# Altium schematic sheet 8051_MOV.SchDoc
size A3; PageSetup: Record=PageOptions|CenterHorizontal=True|CenterVertical=True|PrintScale=0.70|XCorrection=1.00|YCorrection=1.00|PrintKind=1|BorderSize=5000000|LeftOffset=0|BottomOffset=0|Orientation=2|PaperLength=2794|PaperWidth=2159|Scale=100|PaperSource=7|PrintQuality=600|MediaType=1|DitherType=10|PrintScaleMode=1|PaperKind=Letter|PaperIndex=1
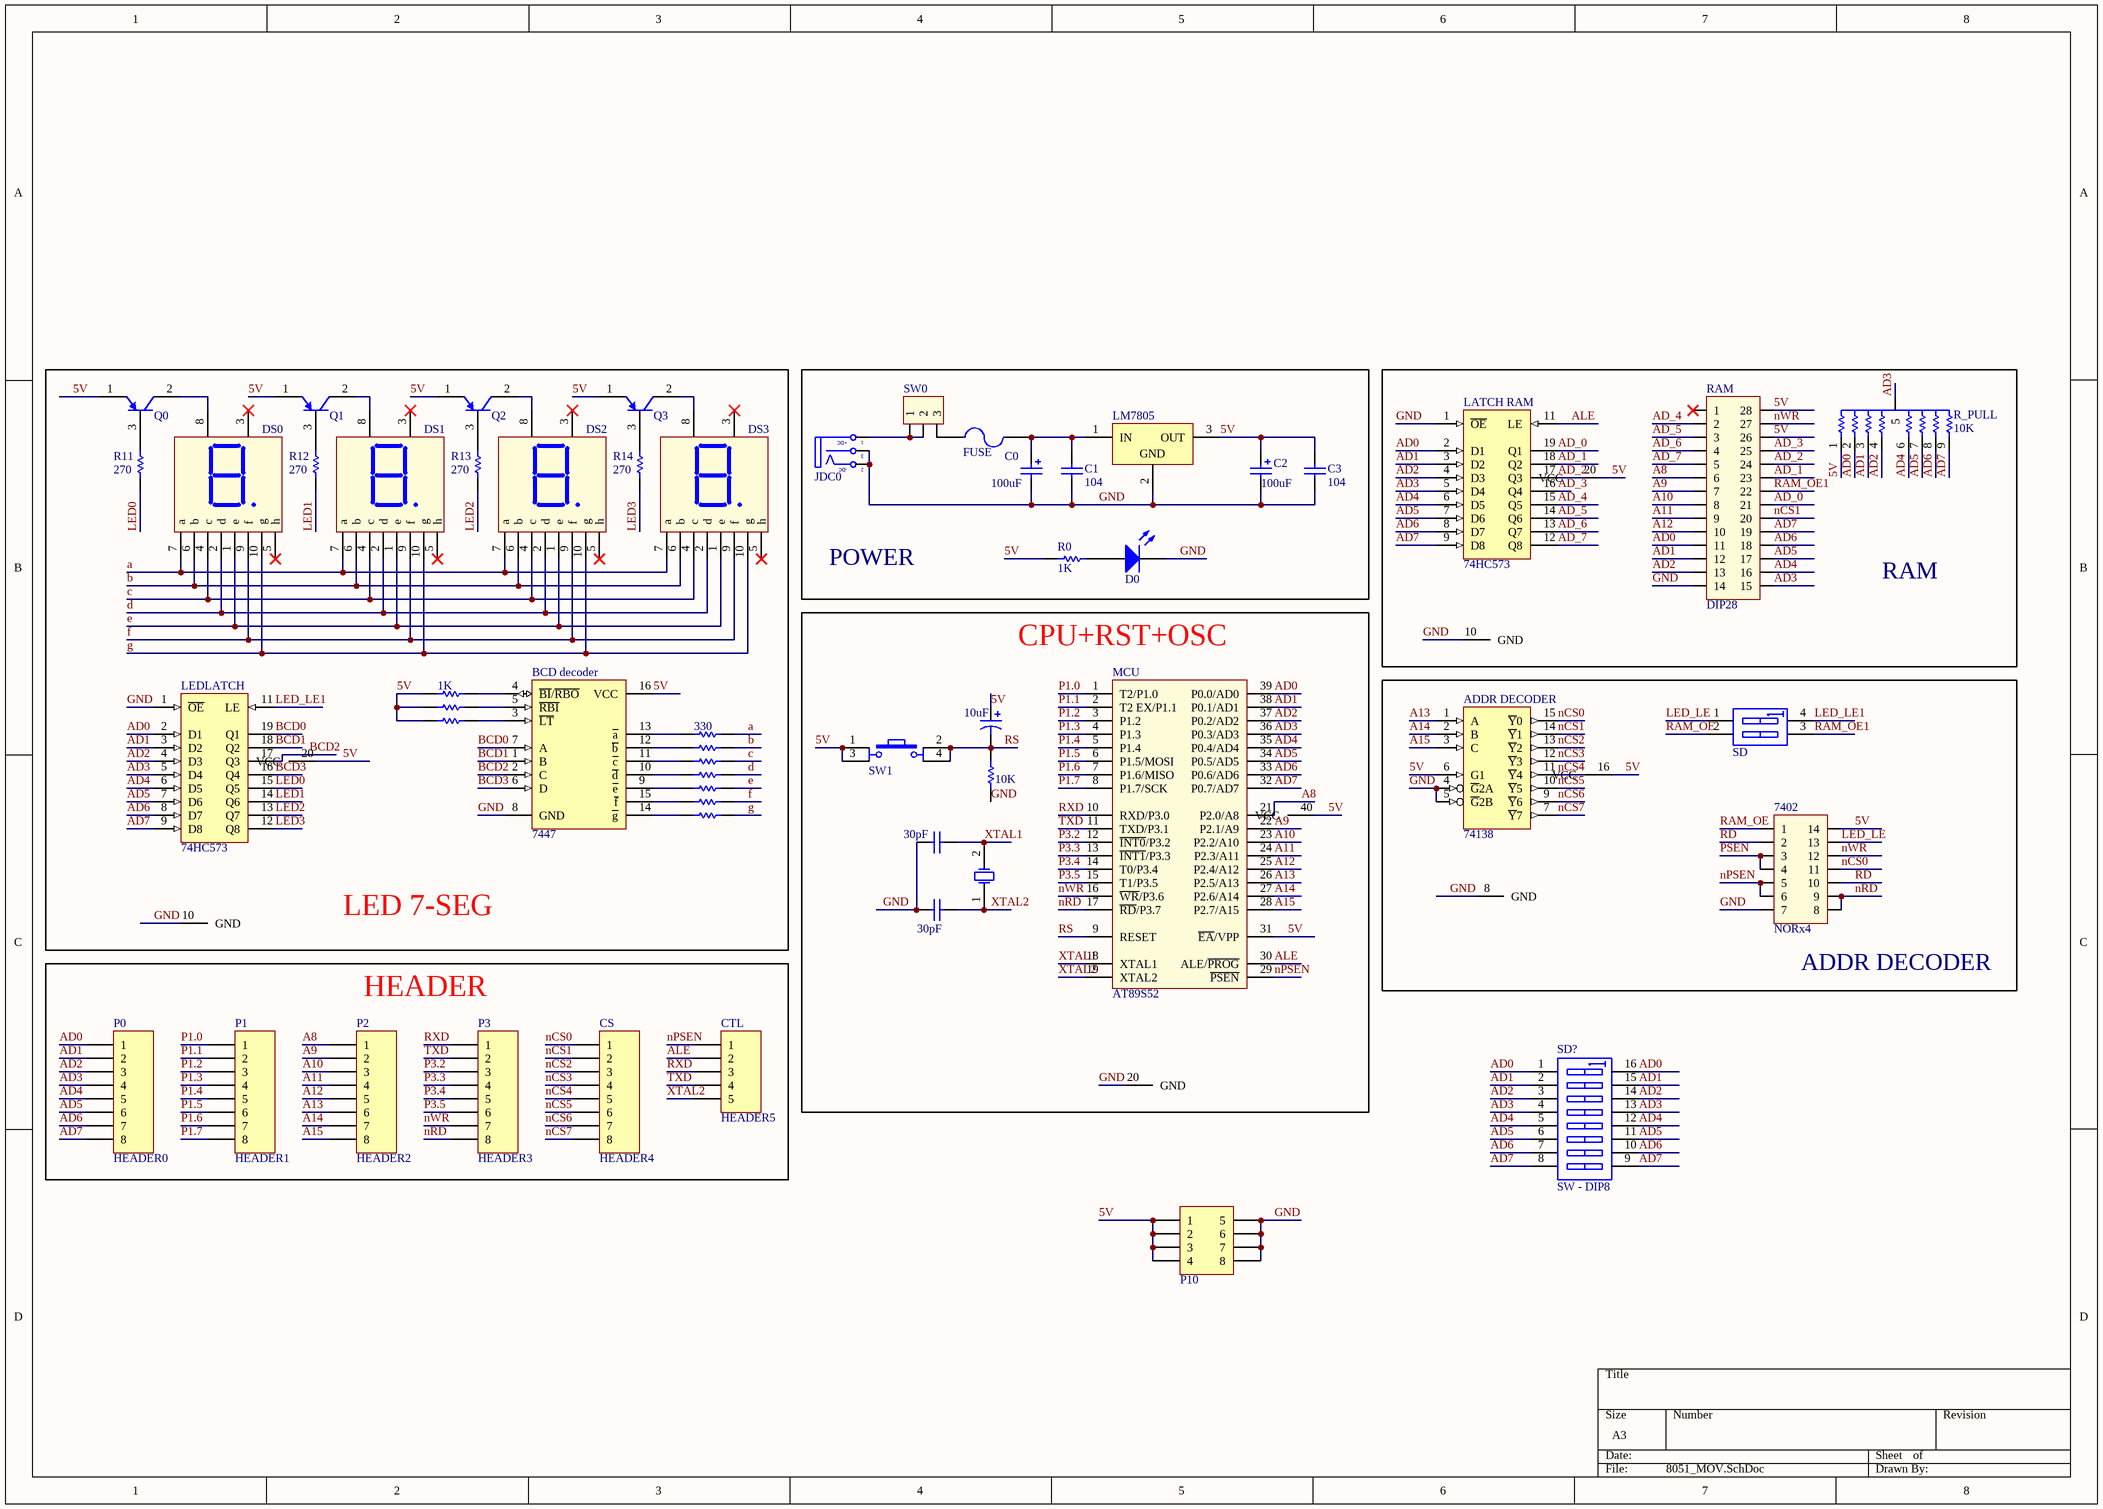
[diagram p0: 8051_MOV.SchDoc]

## Parts
7402  NORx4  [DIP14/W0.3]
ADDR_DECODER  74138  [DIP16/W0.3]
BCD_decoder  7447  [DIP16/W0.3]
C0  value 100uF  [CP1/2]  (hidden comment: Cap Pol)
C1  value 104  [CN1]  (hidden comment: Cap Non-Pol)
C2  value 100uF  [CP1/2]  (hidden comment: Cap Pol)
C3  value 104  [CN1]  (hidden comment: Cap Non-Pol)
Crs  value 10uF  [CP1/2]  (hidden comment: Cap Pol1)
CS  HEADER4  [JP8]
CTL  HEADER5  [JP5]
Cxtal1  value 30pF  [CN1.5]  (hidden comment: Cap)
Cxtal2  value 30pF  [CN1.5]  (hidden comment: Cap)
D0  LED  [LED-3mm]  (value not drawn)
DS0  7SEG S  [7SEGS]  (value not drawn)
DS1  7SEG S  [7SEGS]  (value not drawn)
DS2  7SEG S  [7SEGS]  (value not drawn)
DS3  7SEG S  [7SEGS]  (value not drawn)
FUSE  Fuse  [FUSE]  (value not drawn)
JDC0  Jack DC  [DC-IN]  (value not drawn)
LATCH_RAM  74HC573  [DIP20/W0.3]
LEDLATCH  74HC573  [DIP20/W0.3]
LM7805  LM7805  [QTO-220]  (value not drawn)
MCU  AT89S52  [DIP40/W0.6]
P0  HEADER0  [JP8]
P1  HEADER1  [JP8]
P2  HEADER2  [JP8]
P3  HEADER3  [JP8]
P10  Header 4X2  [JP4x2]  (value not drawn)
Q0  A1015  [QTO-92]  (value not drawn)
Q1  A1015  [QTO-92]  (value not drawn)
Q2  A1015  [QTO-92]  (value not drawn)
Q3  A1015  [QTO-92]  (value not drawn)
R0  value 1K  [RES 1/2W]  (hidden comment: RESISTOR)
R1  value 330  [RES 1/2W]  (hidden comment: RESISTOR)
R2  RESISTOR  [RES 1/2W]  (value not drawn)
R3  RESISTOR  [RES 1/2W]  (value not drawn)
R4  RESISTOR  [RES 1/2W]  (value not drawn)
R5  RESISTOR  [RES 1/2W]  (value not drawn)
R6  RESISTOR  [RES 1/2W]  (value not drawn)
R7  RESISTOR  [RES 1/2W]  (value not drawn)
R8  value 1K  [RES 1/2W]  (hidden comment: RESISTOR)
R9  RESISTOR  [RES 1/2W]  (value not drawn)
R10  RESISTOR  [RES 1/2W]  (value not drawn)
R11  value 270  [RES 1/2W]  (hidden comment: RESISTOR)
R12  value 270  [RES 1/2W]  (hidden comment: RESISTOR)
R13  value 270  [RES 1/2W]  (hidden comment: RESISTOR)
R14  value 270  [RES 1/2W]  (hidden comment: RESISTOR)
R_PULL  10K  [RN8]
RAM  DIP28  [DIP28/W0.3]
Rrs  value 10K  [RES 1/2W]  (hidden comment: Res1)
SD  SW - DIP2  [DIP4/W0.3]  (value not drawn)
SD?  SW - DIP8  [DIP16/W0.3K]
SW0  (no value)  [HED3]
SW1  SW  [Tact SW 4 pin]  (value not drawn)
Y?  XTAL  [XT2]  (value not drawn)

## Blocks framed on the sheet
LED 7-SEG: BCD_decoder DS0-DS3 LEDLATCH Q0-Q3 R1-R14
POWER: C0-C3 D0 FUSE JDC0 LM7805 R0 SW0
RAM: LATCH_RAM R_PULL RAM
CPU+RST+OSC: Crs Cxtal1 Cxtal2 MCU Rrs SW1 Y?
ADDR DECODER: 7402 ADDR_DECODER SD
HEADER: CS CTL P0-P3

## Nets
5V: 7402.14 ADDR_DECODER.6(G1) ADDR_DECODER.16(VCC) BCD_decoder.16(VCC) C2.1 C3.2 Crs.1 LATCH_RAM.20(VCC) LEDLATCH.20(VCC) LM7805.3(OUT) MCU.31(~{EA}/VPP) MCU.40(VCC) P10.1 P10.2 P10.3 P10.4 Q0.1(E) Q1.1(E) Q2.1(E) Q3.1(E) R0.2 R8.1 R9.1 R10.1 R_PULL.1 RAM.26 RAM.28 SW1.1 SW1.3  [also labelled VCC]
GND: 7402.7 ADDR_DECODER.4(~{G}2A) ADDR_DECODER.5(~{G}2B) ADDR_DECODER.8(GND) BCD_decoder.8(GND) C0.2 C1.1 C2.2 C3.1 Cxtal1.1 Cxtal2.1 D0.2(K) JDC0.2(TN) JDC0.3(S) LATCH_RAM.1(~{OE}) LATCH_RAM.10(GND) LEDLATCH.1(~{OE}) LEDLATCH.10(GND) LM7805.2(GND) MCU.20(GND) P10.5 P10.6 P10.7 P10.8 RAM.14 Rrs.1
a: DS0.7(a) DS1.7(a) DS2.7(a) DS3.7(a) R1.2
A8: MCU.21(P2.0/A8) P2.1 RAM.6
A9: MCU.22(P2.1/A9) P2.2 RAM.7
A10: MCU.23(P2.2/A10) P2.3 RAM.8
A11: MCU.24(P2.3/A11) P2.4 RAM.9
A12: MCU.25(P2.4/A12) P2.5 RAM.10
A13: ADDR_DECODER.1(A) MCU.26(P2.5/A13) P2.6
A14: ADDR_DECODER.2(B) MCU.27(P2.6/A14) P2.7
A15: ADDR_DECODER.3(C) MCU.28(P2.7/A15) P2.8
AD0: LATCH_RAM.2(D1) LEDLATCH.2(D1) MCU.39(P0.0/AD0) P0.1 R_PULL.2 RAM.11 SD?.1(A1) SD?.16(B1)
AD1: LATCH_RAM.3(D2) LEDLATCH.3(D2) MCU.38(P0.1/AD1) P0.2 R_PULL.3 RAM.12 SD?.2(A2) SD?.15(B2)
AD2: LATCH_RAM.4(D3) LEDLATCH.4(D3) MCU.37(P0.2/AD2) P0.3 R_PULL.4 RAM.13 SD?.3(A3) SD?.14(B3)
AD3: LATCH_RAM.5(D4) LEDLATCH.5(D4) MCU.36(P0.3/AD3) P0.4 R_PULL.5 RAM.15 SD?.4(A4) SD?.13(B4)
AD4: LATCH_RAM.6(D5) LEDLATCH.6(D5) MCU.35(P0.4/AD4) P0.5 R_PULL.6 RAM.16 SD?.5(A5) SD?.12(B5)
AD5: LATCH_RAM.7(D6) LEDLATCH.7(D6) MCU.34(P0.5/AD5) P0.6 R_PULL.7 RAM.17 SD?.6(A6) SD?.11(B6)
AD6: LATCH_RAM.8(D7) LEDLATCH.8(D7) MCU.33(P0.6/AD6) P0.7 R_PULL.8 RAM.18 SD?.7(A7) SD?.10(B7)
AD7: LATCH_RAM.9(D8) LEDLATCH.9(D8) MCU.32(P0.7/AD7) P0.8 R_PULL.9 RAM.19 SD?.8(A8) SD?.9(B8)
AD_0: LATCH_RAM.19(Q1) RAM.21
AD_1: LATCH_RAM.18(Q2) RAM.23
AD_2: LATCH_RAM.17(Q3) RAM.24
AD_3: LATCH_RAM.16(Q4) RAM.25
AD_4: LATCH_RAM.15(Q5) RAM.2
AD_5: LATCH_RAM.14(Q6) RAM.3
AD_6: LATCH_RAM.13(Q7) RAM.4
AD_7: LATCH_RAM.12(Q8) RAM.5
ALE: CTL.2 LATCH_RAM.11(LE) MCU.30(ALE/~{PROG})
b: DS0.6(b) DS1.6(b) DS2.6(b) DS3.6(b) R2.2
BCD0: BCD_decoder.7(A) LEDLATCH.19(Q1)
BCD1: BCD_decoder.1(B) LEDLATCH.18(Q2)
BCD2: BCD_decoder.2(C) LEDLATCH.17(Q3)
BCD3: BCD_decoder.6(D) LEDLATCH.16(Q4)
c: DS0.4(c) DS1.4(c) DS2.4(c) DS3.4(c) R3.2
d: DS0.2(d) DS1.2(d) DS2.2(d) DS3.2(d) R4.2
e: DS0.1(e) DS1.1(e) DS2.1(e) DS3.1(e) R5.2
f: DS0.9(f) DS1.9(f) DS2.9(f) DS3.9(f) R6.2
g: DS0.10(g) DS1.10(g) DS2.10(g) DS3.10(g) R7.2
LED0: LEDLATCH.15(Q5) R11.1
LED1: LEDLATCH.14(Q6) R12.1
LED2: LEDLATCH.13(Q7) R13.1
LED3: LEDLATCH.12(Q8) R14.1
LED_LE: 7402.13 SD.1(A1)
LED_LE1: LEDLATCH.11(LE) SD.4(A4)
nCS0: 7402.11 ADDR_DECODER.15(~{Y}0) CS.1
nCS1: ADDR_DECODER.14(~{Y}1) CS.2 RAM.20
nCS2: ADDR_DECODER.13(~{Y}2) CS.3
nCS3: ADDR_DECODER.12(~{Y}3) CS.4
nCS4: ADDR_DECODER.11(~{Y}4) CS.5
nCS5: ADDR_DECODER.10(~{Y}5) CS.6
nCS6: ADDR_DECODER.9(~{Y}6) CS.7
nCS7: ADDR_DECODER.7(~{Y}7) CS.8
nPSEN: 7402.5 7402.6 CTL.1 MCU.29(~{PSEN})
nRD: 7402.8 7402.9 MCU.17(~{RD}/P3.7) P3.8
nWR: 7402.12 MCU.16(~{WR}/P3.6) P3.7 RAM.27
P1.0: MCU.1(T2/P1.0) P1.1
P1.1: MCU.2(T2_EX/P1.1) P1.2
P1.2: MCU.3(P1.2) P1.3
P1.3: MCU.4(P1.3) P1.4
P1.4: MCU.5(P1.4) P1.5
P1.5: MCU.6(P1.5/MOSI) P1.6
P1.6: MCU.7(P1.6/MISO) P1.7
P1.7: MCU.8(P1.7/SCK) P1.8
P3.2: MCU.12(~{INT0}/P3.2) P3.3
P3.3: MCU.13(~{INT1}/P3.3) P3.4
P3.4: MCU.14(T0/P3.4) P3.5
P3.5: MCU.15(T1/P3.5) P3.6
PSEN: 7402.3 7402.4
RAM_OE: 7402.1 SD.2(A2)
RAM_OE1: RAM.22 SD.3(A3)
RD: 7402.2 7402.10
RS: Crs.2 MCU.9(RESET) Rrs.2 SW1.2 SW1.4
RXD: CTL.3 MCU.10(RXD/P3.0) P3.1
TXD: CTL.4 MCU.11(TXD/P3.1) P3.2
XTAL1: Cxtal1.2 MCU.18(XTAL1) Y?.2(OSC2)
XTAL2: CTL.5 Cxtal2.2 MCU.19(XTAL2) Y?.1(OSC1)
NetBCD_decoder_3: BCD_decoder.3(~{LT}) R10.2
NetBCD_decoder_4: BCD_decoder.4(~{BI}/~{RBO}) R8.2
NetBCD_decoder_5: BCD_decoder.5(~{RBI}) R9.2
NetBCD_decoder_9: BCD_decoder.9(~{e}) R5.1
NetBCD_decoder_10: BCD_decoder.10(~{d}) R4.1
NetBCD_decoder_11: BCD_decoder.11(~{c}) R3.1
NetBCD_decoder_12: BCD_decoder.12(~{b}) R2.1
NetBCD_decoder_13: BCD_decoder.13(~{a}) R1.1
NetBCD_decoder_14: BCD_decoder.14(~{g}) R7.1
NetBCD_decoder_15: BCD_decoder.15(~{f}) R6.1
NetC0_1: C0.1 C1.2 FUSE.2 LM7805.1(IN)
NetD0_1: D0.1(A) R0.1
NetDS0_8: DS0.8(Vcc) Q0.2(C)
NetDS1_8: DS1.8(Vcc) Q1.2(C)
NetDS2_8: DS2.8(Vcc) Q2.2(C)
NetDS3_8: DS3.8(Vcc) Q3.2(C)
NetFUSE_1: FUSE.1 SW0.3
NetJDC0_1: JDC0.1(T) SW0.1 SW0.2
NetQ0_3: Q0.3(B) R11.2
NetQ1_3: Q1.3(B) R12.2
NetQ2_3: Q2.3(B) R13.2
NetQ3_3: Q3.3(B) R14.2

Not connected (* = marked no-connect by the designer): DS0 3(Vcc)* 5(h)*; DS1 3(Vcc)* 5(h)*; DS2 3(Vcc)* 5(h)*; DS3 3(Vcc)* 5(h)*; RAM 1*

## Notes on the sheet
- (in symbol Jack DC) +DC; -DC

## Library data of the parts
7402 = DIP14: Value: DIP14
ADDR_DECODER = 74138: 3 -to- 8 Decoder - Out Low; Value: 74138; Copyright by: VanDungEvn@Gmail.com
BCD_decoder = 7447: BCD to 7-Segment Decoder/Driver; Value: 7447 , 74247
C0 C2 = Cap Pol: Polarized Capacitor (Radial)
C1 C3 = Cap Non-Pol: Capacitor
Crs = Cap Pol1: Polarized Capacitor (Radial); Published: 8-Jun-2000; LatestRevisionDate: 17-Jul-2002; LatestRevisionNote: Re-released for DXP Platform.; PackageReference: RB7.6-15; Publisher: Altium Limited; PackageDescription: Polarized Capacitor (Radial); 2 Leads
CS = MHDR1X8: Header, 8-Pin; LatestRevisionDate: 17-Jul-2002; LatestRevisionNote: Re-released for DXP Platform.; Publisher: Altium Limited
CTL = Header 5H: Header, 5-Pin, Right Angle; LatestRevisionDate: 17-Jul-2002; LatestRevisionNote: Re-released for DXP Platform.; Publisher: Altium Limited
Cxtal1 Cxtal2 = Cap: Capacitor; Published: 8-Jun-2000; LatestRevisionDate: 17-Jul-2002; LatestRevisionNote: Re-released for DXP Platform.; PackageReference: RAD-0.3; Publisher: Altium Limited; PackageDescription: Radial Cap, Thru-Hole; 2 Leads; 0.3 in Pin Spacing
DS0-DS3 = LED7S: Single 7 Seg Dipslay; Value: LED 7S SEG
JDC0 = Jack DC: Jack DC input; Value: Jac DC
LATCH_RAM LEDLATCH = 74573: Octal D-Type Latch with 3-State Output Non-Inverting; Value: 74HC573; Copyright by: VanDungEvn@Gmail.com
LM7805 = LM7805: Positive Voltage Regulator
MCU = AT89S52: AT89S52, 8k Byte Flash Memory , 40 Pin; Value: AT89S52
P0-P3 = Header 8: Header, 8-Pin; LatestRevisionDate: 17-Jul-2002; LatestRevisionNote: Re-released for DXP Platform.; Publisher: Altium Limited
P10 = Header 4X2: Header, 4-Pin, Dual row; LatestRevisionDate: 17-Jul-2002; LatestRevisionNote: Re-released for DXP Platform.; Publisher: Altium Limited
Q0-Q3 = A1015: PNP Bipolar Transistor
R2-R7 = RESISTOR: Value: 330
R9 R10 = RESISTOR: Value: 1K
R_PULL = RKC8LD: Resistor Pack 4x2; Value: 10K
Rrs = Res1: Resistor; Published: 8-Jun-2000; LatestRevisionDate: 17-Jul-2002; LatestRevisionNote: Re-released for DXP Platform.; PackageReference: AXIAL-0.3; Publisher: Altium Limited; PackageDescription: Axial Device, Thru-Hole; 2 Leads; 0.3 in Pin Spacing
SD = SWDIP-2: DIP Switch, 2 Position, SPST; Value: SW - DIP2
SD? = SWDIP-8: DIP Switch, 8 Position, SPST; Value: SW - DIP8
SW0 = Hed3: Header 3 (Green); Value: Header 3
SW1 = Tact SW - 4Pin: Switch button 4 pin; Value: Button chip 4 pin
Y? = XTAL: Crystal Oscillator; Published: 8-Jun-2000; LatestRevisionDate: 17-Jul-2002; LatestRevisionNote: Re-released for DXP Platform.; PackageReference: R38; Publisher: Altium Limited; PackageDescription: Crystal, Thru-Hole; 2 Leads; Body 3.1 x 8.2 mm (Dia.xH)
RAM = DIP28: Value: DIP28